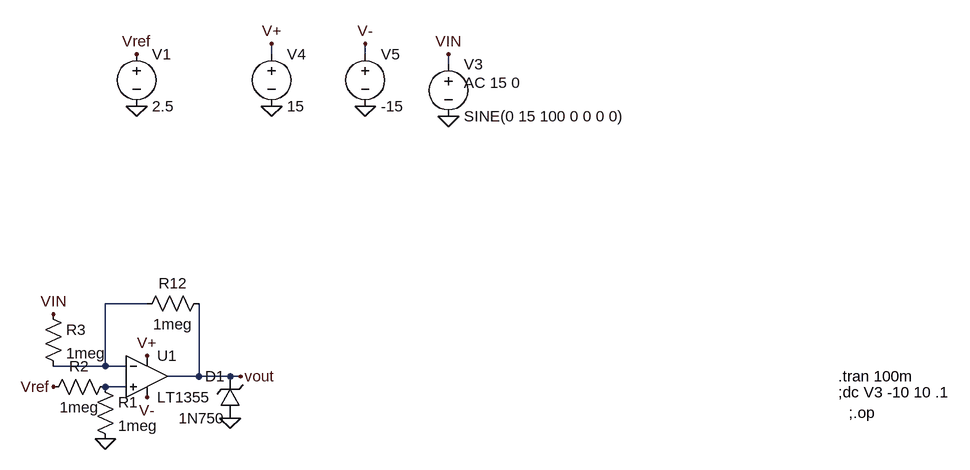
[diagram p0: schematic summer.asc]
summer.asc, the LTspice schematic file:
Version 4
SHEET 1 992 932
WIRE -80 -224 -80 -240
WIRE 64 -224 64 -240
WIRE 192 -208 192 -224
WIRE -272 160 -336 160
WIRE -336 256 -336 160
WIRE -336 256 -416 256
WIRE -304 256 -336 256
WIRE -192 272 -192 160
WIRE -192 272 -240 272
WIRE -144 272 -192 272
WIRE -128 272 -144 272
WIRE -304 288 -336 288
FLAG 192 -128 0
FLAG 192 -224 VIN
FLAG -80 -144 0
FLAG 64 -144 0
FLAG -80 -240 V+
FLAG 64 -240 V-
FLAG -272 240 V+
FLAG -272 304 V-
FLAG -128 272 vout
FLAG -416 176 VIN
FLAG -288 -144 0
FLAG -288 -224 Vref
FLAG -416 288 Vref
FLAG -336 368 0
FLAG -144 336 0
SYMBOL voltage 192 -224 R0
WINDOW 123 24 44 Left 2
WINDOW 39 0 0 Left 2
SYMATTR Value2 AC 15 0
SYMATTR InstName V3
SYMATTR Value SINE(0 15 100 0 0 0 0)
SYMBOL voltage -80 -240 R0
WINDOW 123 0 0 Left 2
WINDOW 39 0 0 Left 2
SYMATTR InstName V4
SYMATTR Value 15
SYMBOL voltage 64 -240 R0
WINDOW 123 0 0 Left 2
WINDOW 39 0 0 Left 2
SYMATTR InstName V5
SYMATTR Value -15
SYMBOL Opamps\\LT1355 -272 208 R0
SYMATTR InstName U1
SYMBOL res -176 144 R90
WINDOW 0 0 56 VBottom 2
WINDOW 3 32 56 VTop 2
SYMATTR InstName R12
SYMATTR Value 1meg
SYMBOL voltage -288 -240 R0
WINDOW 123 0 0 Left 2
WINDOW 39 0 0 Left 2
SYMATTR InstName V1
SYMATTR Value 2.5
SYMBOL res -352 272 R0
SYMATTR InstName R1
SYMATTR Value 1meg
SYMBOL res -320 272 R90
WINDOW 0 0 56 VBottom 2
WINDOW 3 32 56 VTop 2
SYMATTR InstName R2
SYMATTR Value 1meg
SYMBOL res -432 160 R0
SYMATTR InstName R3
SYMATTR Value 1meg
SYMBOL zener -128 336 R180
WINDOW 0 24 64 Left 2
WINDOW 3 24 0 Left 2
SYMATTR InstName D1
SYMATTR Value 1N750
TEXT 792 296 Left 2 !;dc V3 -10 10 .1
TEXT 792 272 Left 2 !.tran 100m
TEXT 808 328 Left 2 !;.op

The netlist it stands for:
* summer.asc
V3 VIN 0 SINE(0 15 100 0 0 0 0) AC 15 0
V4 V+ 0 15
V5 V- 0 -15
XU1 N002 N001 V+ V- vout LT1355  ; pins In+ In- V+ V- OUT
R12 vout N001 1meg
V1 Vref 0 2.5
R1 N002 0 1meg
R2 N002 Vref 1meg
R3 VIN N001 1meg
D1 0 vout 1N750
.model D D
.lib standard.dio
;dc V3 -10 10 .1
.tran 100m
;.op
.backanno
.end